# Altium schematic sheet MASTER_SHEET.SchDoc: ESP32-S3-DevKitC-1
size A; Author: Mohamed Khalid; SheetNumber: 1; SheetTotal: 8
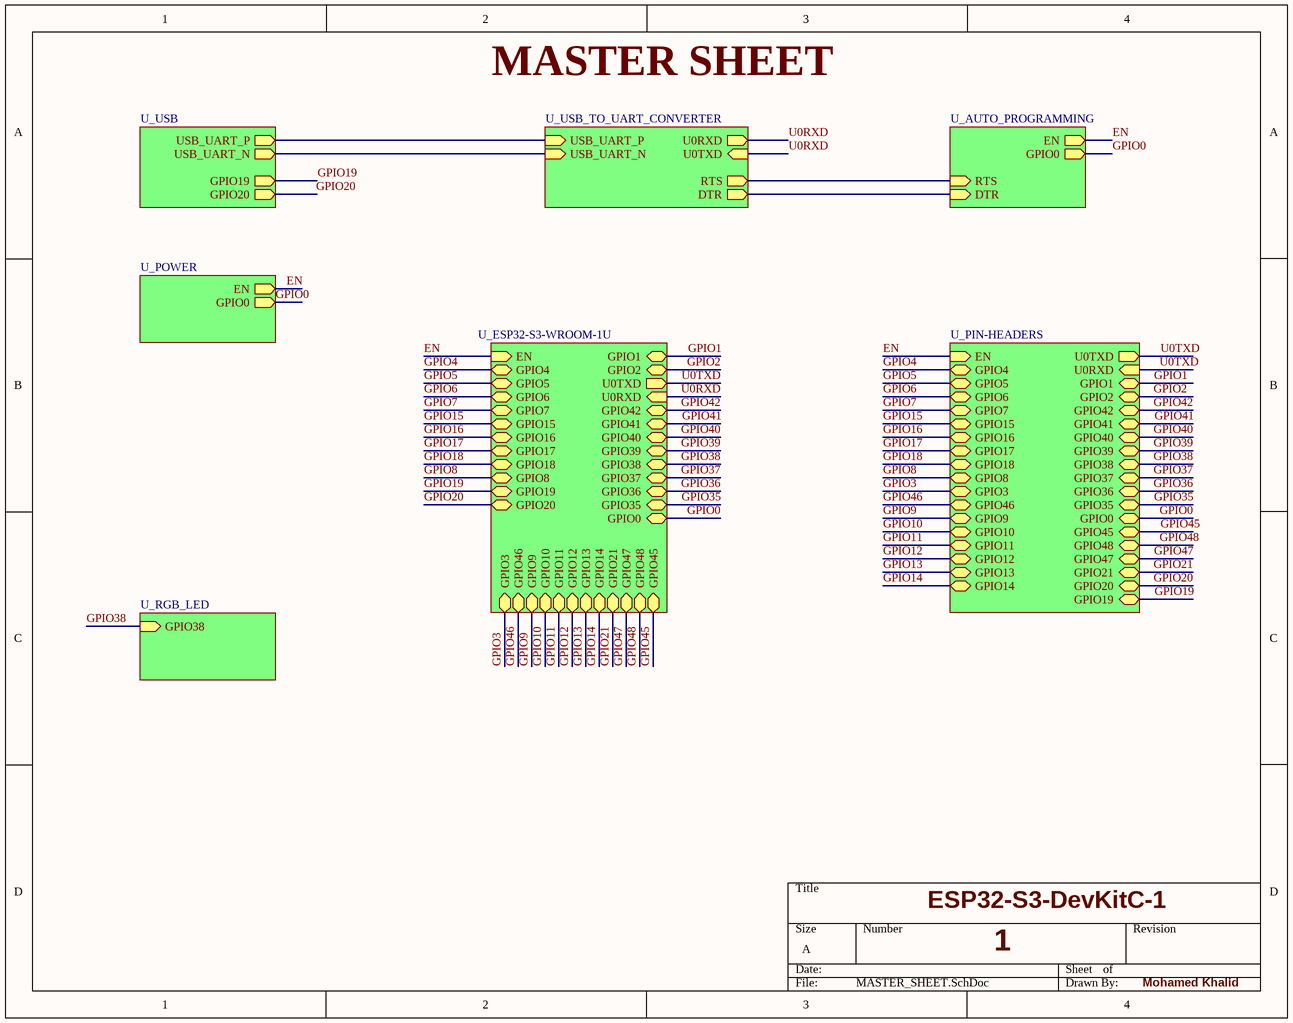
[diagram p0: MASTER_SHEET.SchDoc]

## Sub-sheets
U_AUTO_PROGRAMMING = AUTO_PROGRAMMING.SchDoc: DTR (in), RTS (in), EN (out), GPIO0 (out)
U_ESP32-S3-WROOM-1U = ESP32-S3-WROOM-1U.SchDoc: GPIO1 (bidir), GPIO2 (bidir), GPIO42 (bidir), GPIO41 (bidir), GPIO40 (bidir), GPIO39 (bidir), GPIO38 (bidir), GPIO37 (bidir), GPIO36 (bidir), GPIO35 (bidir), GPIO0 (bidir), EN (in), GPIO4 (bidir), GPIO5 (bidir), GPIO6 (bidir), GPIO15 (bidir), GPIO16 (bidir), GPIO17 (bidir), GPIO18 (bidir), GPIO8 (bidir), GPIO19 (bidir), GPIO20 (bidir), GPIO45 (bidir), GPIO48 (bidir), GPIO47 (bidir), GPIO21 (bidir), GPIO14 (bidir), GPIO12 (bidir), GPIO11 (bidir), GPIO10 (bidir), GPIO9 (bidir), GPIO46 (bidir), GPIO3 (bidir), GPIO13 (bidir), GPIO7 (bidir), U0TXD (out), U0RXD (in)
U_PIN-HEADERS = PIN-HEADERS.SchDoc: GPIO4 (bidir), GPIO5 (bidir), GPIO6 (bidir), GPIO7 (bidir), GPIO15 (bidir), GPIO16 (bidir), GPIO17 (bidir), GPIO18 (bidir), GPIO8 (bidir), GPIO1 (bidir), GPIO2 (bidir), GPIO42 (bidir), GPIO41 (bidir), GPIO40 (bidir), GPIO39 (bidir), GPIO38 (bidir), GPIO37 (bidir), GPIO36 (bidir), GPIO35 (bidir), GPIO0 (bidir), GPIO45 (bidir), GPIO48 (bidir), GPIO47 (bidir), GPIO21 (bidir), GPIO14 (bidir), GPIO12 (bidir), GPIO11 (bidir), GPIO10 (bidir), GPIO9 (bidir), GPIO46 (bidir), GPIO3 (bidir), GPIO13 (bidir), GPIO19 (bidir), GPIO20 (bidir), U0TXD (out), U0RXD (in), EN (in)
U_POWER = POWER.SchDoc: EN (out), GPIO0 (out)
U_RGB_LED = RGB_LED.SchDoc: GPIO38 (in)
U_USB = USB.SchDoc: USB_UART_P (out), USB_UART_N (out), GPIO19 (out), GPIO20 (out)
U_USB_TO_UART_CONVERTER = USB_TO_UART_CONVERTER.SchDoc: USB_UART_P (in), USB_UART_N (in), U0TXD (in), U0RXD (out), RTS (out), DTR (out)

## Nets
EN: sheet U_ESP32-S3-WROOM-1U/EN, sheet U_PIN-HEADERS/EN, sheet U_AUTO_PROGRAMMING/EN, sheet U_POWER/EN
GPIO0: sheet U_ESP32-S3-WROOM-1U/GPIO0, sheet U_PIN-HEADERS/GPIO0, sheet U_AUTO_PROGRAMMING/GPIO0, sheet U_POWER/GPIO0
GPIO1: sheet U_ESP32-S3-WROOM-1U/GPIO1, sheet U_PIN-HEADERS/GPIO1
GPIO2: sheet U_ESP32-S3-WROOM-1U/GPIO2, sheet U_PIN-HEADERS/GPIO2
GPIO3: sheet U_ESP32-S3-WROOM-1U/GPIO3, sheet U_PIN-HEADERS/GPIO3
GPIO4: sheet U_ESP32-S3-WROOM-1U/GPIO4, sheet U_PIN-HEADERS/GPIO4
GPIO5: sheet U_ESP32-S3-WROOM-1U/GPIO5, sheet U_PIN-HEADERS/GPIO5
GPIO6: sheet U_ESP32-S3-WROOM-1U/GPIO6, sheet U_PIN-HEADERS/GPIO6
GPIO7: sheet U_ESP32-S3-WROOM-1U/GPIO7, sheet U_PIN-HEADERS/GPIO7
GPIO8: sheet U_ESP32-S3-WROOM-1U/GPIO8, sheet U_PIN-HEADERS/GPIO8
GPIO9: sheet U_ESP32-S3-WROOM-1U/GPIO9, sheet U_PIN-HEADERS/GPIO9
GPIO10: sheet U_ESP32-S3-WROOM-1U/GPIO10, sheet U_PIN-HEADERS/GPIO10
GPIO11: sheet U_ESP32-S3-WROOM-1U/GPIO11, sheet U_PIN-HEADERS/GPIO11
GPIO12: sheet U_ESP32-S3-WROOM-1U/GPIO12, sheet U_PIN-HEADERS/GPIO12
GPIO13: sheet U_ESP32-S3-WROOM-1U/GPIO13, sheet U_PIN-HEADERS/GPIO13
GPIO14: sheet U_ESP32-S3-WROOM-1U/GPIO14, sheet U_PIN-HEADERS/GPIO14
GPIO15: sheet U_ESP32-S3-WROOM-1U/GPIO15, sheet U_PIN-HEADERS/GPIO15
GPIO16: sheet U_ESP32-S3-WROOM-1U/GPIO16, sheet U_PIN-HEADERS/GPIO16
GPIO17: sheet U_ESP32-S3-WROOM-1U/GPIO17, sheet U_PIN-HEADERS/GPIO17
GPIO18: sheet U_ESP32-S3-WROOM-1U/GPIO18, sheet U_PIN-HEADERS/GPIO18
GPIO19: sheet U_ESP32-S3-WROOM-1U/GPIO19, sheet U_PIN-HEADERS/GPIO19, sheet U_USB/GPIO19
GPIO20: sheet U_ESP32-S3-WROOM-1U/GPIO20, sheet U_PIN-HEADERS/GPIO20, sheet U_USB/GPIO20
GPIO21: sheet U_ESP32-S3-WROOM-1U/GPIO21, sheet U_PIN-HEADERS/GPIO21
GPIO35: sheet U_ESP32-S3-WROOM-1U/GPIO35, sheet U_PIN-HEADERS/GPIO35
GPIO36: sheet U_ESP32-S3-WROOM-1U/GPIO36, sheet U_PIN-HEADERS/GPIO36
GPIO37: sheet U_ESP32-S3-WROOM-1U/GPIO37, sheet U_PIN-HEADERS/GPIO37
GPIO38: sheet U_ESP32-S3-WROOM-1U/GPIO38, sheet U_PIN-HEADERS/GPIO38, sheet U_RGB_LED/GPIO38
GPIO39: sheet U_ESP32-S3-WROOM-1U/GPIO39, sheet U_PIN-HEADERS/GPIO39
GPIO40: sheet U_ESP32-S3-WROOM-1U/GPIO40, sheet U_PIN-HEADERS/GPIO40
GPIO41: sheet U_ESP32-S3-WROOM-1U/GPIO41, sheet U_PIN-HEADERS/GPIO41
GPIO42: sheet U_ESP32-S3-WROOM-1U/GPIO42, sheet U_PIN-HEADERS/GPIO42
GPIO45: sheet U_ESP32-S3-WROOM-1U/GPIO45, sheet U_PIN-HEADERS/GPIO45
GPIO46: sheet U_ESP32-S3-WROOM-1U/GPIO46, sheet U_PIN-HEADERS/GPIO46
GPIO47: sheet U_ESP32-S3-WROOM-1U/GPIO47, sheet U_PIN-HEADERS/GPIO47
GPIO48: sheet U_ESP32-S3-WROOM-1U/GPIO48, sheet U_PIN-HEADERS/GPIO48
U0RXD: sheet U_USB_TO_UART_CONVERTER/U0TXD, sheet U_USB_TO_UART_CONVERTER/U0RXD, sheet U_ESP32-S3-WROOM-1U/U0RXD
U0TXD: sheet U_ESP32-S3-WROOM-1U/U0TXD, sheet U_PIN-HEADERS/U0TXD, sheet U_PIN-HEADERS/U0RXD
(unnamed): sheet U_USB_TO_UART_CONVERTER/USB_UART_P, sheet U_USB/USB_UART_P
(unnamed): sheet U_USB_TO_UART_CONVERTER/USB_UART_N, sheet U_USB/USB_UART_N
(unnamed): sheet U_USB_TO_UART_CONVERTER/RTS, sheet U_AUTO_PROGRAMMING/RTS
(unnamed): sheet U_USB_TO_UART_CONVERTER/DTR, sheet U_AUTO_PROGRAMMING/DTR

## Notes on the sheet
- MASTER SHEET
- ESP32-S3-DevKitC-1
- 1
- Mohamed Khalid